# Altium project testing_board.PrjPcb
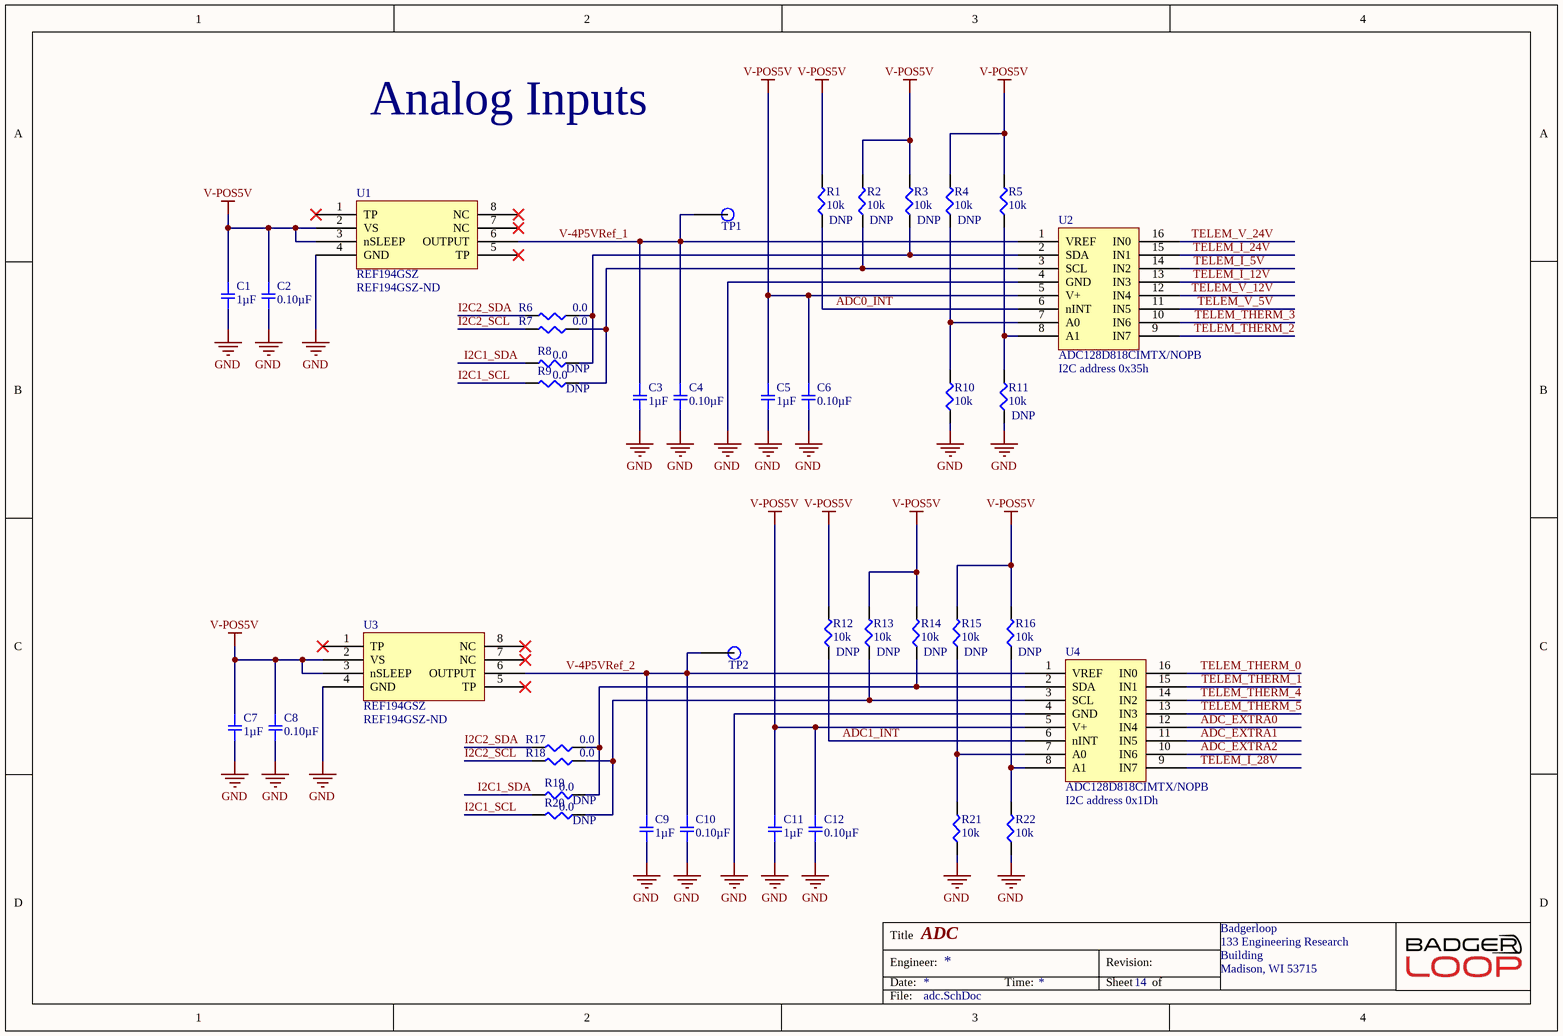
[diagram p0: adc.SchDoc]
11 sheets, 106 parts. Net scope: global (net labels, ports and power ports of the same name join across sheets).
Board file: testing_board.PcbDoc
Sheets:
  adc.SchDoc
  gpio.SchDoc
  power_5V.SchDoc
  dac.SchDoc
  pi.SchDoc
  current_source.SchDoc
  mosfet.SchDoc
  relay.SchDoc
  connectors.SchDoc
  testing_board.SchDoc
  serial.SchDoc

## Sheet adc.SchDoc: ADC
size A4; Organization: Badgerloop; Address1: 133 Engineering Research; Address2: Building; Address3: Madison, WI 53715; SheetNumber: 14

### Parts
C1  1µF  [SMD-0805C]
C2  0.10µF  [SMD-0805C]
C3  1µF  [SMD-0805C]
C4  0.10µF  [SMD-0805C]
C5  1µF  [SMD-0805C]
C6  0.10µF  [SMD-0805C]
C7  1µF  [SMD-0805C]
C8  0.10µF  [SMD-0805C]
C9  1µF  [SMD-0805C]
C10  0.10µF  [SMD-0805C]
C11  1µF  [SMD-0805C]
C12  0.10µF  [SMD-0805C]
R1  10k  [SMD-0805-RES]
R2  10k  [SMD-0805-RES]
R3  10k  [SMD-0805-RES]
R4  10k  [SMD-0805-RES]
R5  10k  [SMD-0805-RES]
R6  0.0  [SMD-0805-RES]
R7  0.0  [SMD-0805-RES]
R8  0.0  [SMD-0805-RES]
R9  0.0  [SMD-0805-RES]
R10  10k  [SMD-0805-RES]
R11  10k  [SMD-0805-RES]
R12  10k  [SMD-0805-RES]
R13  10k  [SMD-0805-RES]
R14  10k  [SMD-0805-RES]
R15  10k  [SMD-0805-RES]
R16  10k  [SMD-0805-RES]
R17  0.0  [SMD-0805-RES]
R18  0.0  [SMD-0805-RES]
R19  0.0  [SMD-0805-RES]
R20  0.0  [SMD-0805-RES]
R21  10k  [SMD-0805-RES]
R22  10k  [SMD-0805-RES]
TP1  TP  [Test Point]  (value not drawn)
TP2  TP  [Test Point]  (value not drawn)
U1  REF194GSZ  Supplier Part Number 1: REF194GSZ-ND  [SOP127P600X175-8N]
U2  ADC128D818CIMTX/NOPB  [TSOP65P660X120-16N]
U3  REF194GSZ  Supplier Part Number 1: REF194GSZ-ND  [SOP127P600X175-8N]
U4  ADC128D818CIMTX/NOPB  [TSOP65P660X120-16N]

### Nets
GND: C1.2 C2.2 C3.2 C4.2 C5.2 C6.2 C7.2 C8.2 C9.2 C10.2 C11.2 C12.2 R10.1 R11.1 R21.1 R22.1 U1.4(GND) U2.4(GND) U3.4(GND) U4.4(GND)
V-POS5V: C1.1 C2.1 C5.1 C6.1 C7.1 C8.1 C11.1 C12.1 R1.2 R2.2 R3.2 R4.2 R5.2 R12.2 R13.2 R14.2 R15.2 R16.2 U1.2(VS) U1.3(nSLEEP) U2.5(V+) U3.2(VS) U3.3(nSLEEP) U4.5(V+)
ADC0_INT: R1.1 U2.6(nINT)
ADC1_INT: R12.1 U4.6(nINT)
ADC_EXTRA0: U4.12(IN4)
ADC_EXTRA1: U4.11(IN5)
ADC_EXTRA2: U4.10(IN6)
I2C1_SCL: R9.2 R20.2
I2C1_SDA: R8.2 R19.2
I2C2_SCL: R7.2 R18.2
I2C2_SDA: R6.2 R17.2
TELEM_I_5V: U2.14(IN2)
TELEM_I_12V: U2.13(IN3)
TELEM_I_24V: U2.15(IN1)
TELEM_I_28V: U4.9(IN7)
TELEM_THERM_0: U4.16(IN0)
TELEM_THERM_1: U4.15(IN1)
TELEM_THERM_2: U2.9(IN7)
TELEM_THERM_3: U2.10(IN6)
TELEM_THERM_4: U4.14(IN2)
TELEM_THERM_5: U4.13(IN3)
TELEM_V_5V: U2.11(IN5)
TELEM_V_12V: U2.12(IN4)
TELEM_V_24V: U2.16(IN0)
V-4P5VRef_1: C3.1 C4.1 TP1.1 U1.6(OUTPUT) U2.1(VREF)
V-4P5VRef_2: C9.1 C10.1 TP2.1 U3.6(OUTPUT) U4.1(VREF)
NetR2_1: R2.1 R7.1 R9.1 U2.3(SCL)
NetR3_1: R3.1 R6.1 R8.1 U2.2(SDA)
NetR4_1: R4.1 R10.2 U2.7(A0)
NetR5_1: R5.1 R11.2 U2.8(A1)
NetR13_1: R13.1 R18.1 R20.1 U4.3(SCL)
NetR14_1: R14.1 R17.1 R19.1 U4.2(SDA)
NetR15_1: R15.1 R21.2 U4.7(A0)
NetR16_1: R16.1 R22.2 U4.8(A1)

Not connected (* = marked no-connect by the designer): U1 1(TP)* 5(TP)* 7(NC)* 8(NC)*; U3 1(TP)* 5(TP)* 7(NC)* 8(NC)*

### Notes on the sheet
- Analog Inputs
- (near U2) I2C address 0x35h
- (near U4) I2C address 0x1Dh
- Title
- Engineer:
- Date:
- Time:
- Revision:
- Sheet
- of
- File:

### Library data of the parts
C1 C3 C5 C7 C9 C11 = GRM21BR71H105KA12L: CAP CER 1UF 50V X7R 0805; Manufacturer: Murata Electronics North America; Factory Stock: 0; Unit Price (USD): 0.25; Minimum Quantity: 1; Tolerance: ±10%; Datasheets: http://www.murata.com/~/media/webrenewal/support/library/catalog/products/capacitor/mlcc/c02e.pdf; Image: //media.digikey.com/Renders/Murata%20Renders/0805%20(2012%20Metric)%20.85mm.jpg; Digi-Key Part Number: 490-4736-1-ND; Part Number: GRM21BR71H105KA12L; Quantity Available: 988032; @ qty: 0; Packaging: Cut Tape (CT); Series: GRM; Part Status: Active; Value: 1µF; Voltage: 50V; Temperature Coefficient: X7R; Operating Temperature: -55°C ~ 125°C; Features: -; Ratings: -; Applications: General Purpose; Mounting Type: Surface Mount, MLCC; Package / Case: 0805 (2012 Metric); Size / Dimension: 0.079" L x 0.049" W (2.00mm x 1.25mm); Height - Seated (Max): -; Thickness (Max): 0.053" (1.35mm); Lead Spacing: -; Lead Style: -
C2 C4 C6 C8 C10 C12 = GCD21BR71H104KA01L: CAP CER 0.1UF 50V X7R 0805; Manufacturer: Murata Electronics North America; Factory Stock: 0; Unit Price (USD): 0.24; Minimum Quantity: 1; Tolerance: ±10%; Datasheets: http://www.murata.com/~/media/webrenewal/support/library/catalog/products/capacitor/mlcc/c03e.ashx; Image: //media.digikey.com/Renders/Murata%20Renders/0805%28GxM6%29.jpg; Digi-Key Part Number: 490-11955-1-ND; Part Number: GCD21BR71H104KA01L; Quantity Available: 157; @ qty: 0; Packaging: Cut Tape (CT); Series: GCD; Part Status: Active; Value: 0.10µF; Voltage: 50V; Temperature Coefficient: X7R; Operating Temperature: -55°C ~ 125°C; Features: -; Ratings: AEC-Q200; Applications: Automotive; Mounting Type: Surface Mount, MLCC; Package / Case: 0805 (2012 Metric); Size / Dimension: 0.079" L x 0.049" W (2.00mm x 1.25mm); Height - Seated (Max): -; Thickness (Max): 0.049" (1.25mm); Lead Spacing: -; Lead Style: -
R1-R5 R10-R16 R21 R22 = ERJ-P06J103V: RES SMD 10K OHM 5% 1/2W 0805; Manufacturer: Panasonic Electronic Components; Factory Stock: 0; Unit Price (USD): 0.01839; @ qty: 1500; Minimum Quantity: 1; Power (Watts): 0.5W, 1/2W; Temperature Coefficient: ±200ppm/°C; Part Number: ERJ-P06J103V; Datasheets: https://industrial.panasonic.com/cdbs/www-data/pdf/RDA0000/AOA0000C243.pdf; Image: //media.digikey.com/Renders/Panasonic%20Renders/ERJ-0805%20Pkg.jpg; Digi-Key Part Number: P10KADCT-ND; Quantity Available: 413576; Packaging: Cut Tape (CT); Series: ERJ; Part Status: Active; Value: 10k; Tolerance: ±5%; Composition: Thick Film; Features: Automotive AEC-Q200, Pulse Withstanding; Operating Temperature: -55°C ~ 155°C; Package / Case: 0805 (2012 Metric); Supplier Device Package: 0805; Size / Dimension: 0.079" L x 0.049" W (2.00mm x 1.25mm); Height - Seated (Max): 0.028" (0.70mm); Number of Terminations: 2; Failure Rate: -
  R1-R4 R11-R16: DNP: DNP
R6-R9 R17-R20 = ERJ-6GEY0R00V: RES SMD 0.0 OHM JUMPER 1/8W 0805; Manufacturer: Panasonic Electronic Components; Factory Stock: 0; Unit Price (USD): 0.00544; @ qty: 1500; Minimum Quantity: 1; Power (Watts): 0.125W, 1/8W; Part Number: ERJ-6GEY0R00V; Datasheets: http://industrial.panasonic.com/www-cgi/jvcr13pz.cgi?E+PZ+3+AOA0001+ERJ6GEY0R00V+7+WW; Image: //media.digikey.com/Renders/Panasonic%20Renders/ERJ-0805%20Pkg.jpg; Digi-Key Part Number: P0.0ACT-ND; Quantity Available: 1597627; Packaging: Cut Tape (CT); Series: ERJ; Part Status: Active; Value: 0.0; Tolerance: Jumper; Composition: Thick Film; Features: Automotive AEC-Q200; Temperature Coefficient: -; Operating Temperature: -55°C ~ 155°C; Package / Case: 0805 (2012 Metric); Supplier Device Package: 0805; Size / Dimension: 0.079" L x 0.049" W (2.00mm x 1.25mm); Height - Seated (Max): 0.028" (0.70mm); Number of Terminations: 2; Failure Rate: -
  R8 R9 R19 R20: DNP: DNP
TP1 TP2 = TP: SMD TEST POINT
U1 U3 = REF194GSZ: IC VREF SERIES 4.5V 8SOIC; Manufacturer: Analog Devices; Max Input Voltage: 18V; Max Output Current: 30mA; Temperature Coefficient: 25ppm/°C; Number of Channels: 1; Min Output Voltage: 4.49V; Operating Supply Current: 45uA; Quiescent Current: 15uA; Min Input Voltage: 4.75V; Supplier 1: Digi-Key; Manufacturer Part Number: REF194GSZ; Stock 1: 359; Pricing 1: 1=3.56000, 10=3.19700, 25=3.02240, 100=2.61940, 250=2.48512, 500=2.22988, 1000=1.88062, 2500=1.78659 (USD); RoHS: Yes; Case/Package: R; Number of Pins: 8; Min Operating Temperature: -40°C; Max Operating Temperature: 85°C; Output Voltage: 4.5V; Packaging: Rail/Tube; Output Current: 30mA; Max Output Voltage: 4.5V; Reference Type: Series; Package Quantity: 98; Nominal Supply Current: 45uA; Reference Voltage: 4.5V; Length: 5mm; Height: 1.5mm; Width: 4mm; Radiation Hardening: No; Lead Free: Contains Lead; REACH SVHC: No SVHC; ComponentLink1URL: https://datasheet.ciiva.com/17219/ref19xseries-17219157.pdf?src-supplier=Avnet+Europe; ComponentLink1Description: https://datasheet.ciiva.com/17219/ref19xseries-17219157.pdf?src-supplier=Avnet+Europe; ComponentLink2URL: https://datasheet.ciiva.com/22666/1506113-22666153.pdf?src-supplier=Element14; ComponentLink2Description: https://datasheet.ciiva.com/22666/1506113-22666153.pdf?src-supplier=Element14; ComponentLink3URL: https://datasheet.ciiva.com/2005/ref19xseries-2005902.pdf?src-supplier=Digi-Key; ComponentLink3Description: https://datasheet.ciiva.com/2005/ref19xseries-2005902.pdf?src-supplier=Digi-Key; ComponentLink4URL: https://datasheet.ciiva.com/3235/ref19xseries-3235518.pdf?src-supplier=Avnet; ComponentLink4Description: https://datasheet.ciiva.com/3235/ref19xseries-3235518.pdf?src-supplier=Avnet
U2 U4 = ADC128D818CIMTX/NOPB: Analog to Digital Converters - ADC; Manufacturer: TI National Semiconductor; Resolution: 12b; Sampling Rate: 10000S/s; Number of A/D Converters: 1; Polarity: Unipolar; Max Supply Voltage: 5.5V; Min Supply Voltage: 3V; Interface: I2C; Number of Channels: 8; Max Power Dissipation: 33mW; Number of Converters: 4; Number of Bits: 12; Integral Nonlinearity (INL): -2LSB; Supply Type: Analog,Digital,Single; Power Consumption: 2mW; Power Dissipation: 2.01mW; Differential Nonlinearity: 1LSB; Supplier 1: Digi-Key; Manufacturer Part Number: ADC128D818CIMTX/NOPB; Stock 1: 21177; Pricing 1: 1=4.68000, 10=4.20700, 100=3.44660, 500=2.93402, 1000=2.47447 (USD); RoHS: Yes; Mount: Surface Mount; Case/Package: TSSOP; Number of Pins: 16; Contact Plating: Tin,Matte; Min Operating Temperature: -40°C; Max Operating Temperature: 125°C; Packaging: Tape and Reel; Package Quantity: 2500; Number of Inputs: 8; Number of Elements: 1; Radiation Hardening: No; Lead Free: Lead Free; ComponentLink1URL: https://datasheet.ciiva.com/14259/adc128d818-14259977.pdf?src-supplier=Avnet; ComponentLink1Description: https://datasheet.ciiva.com/14259/adc128d818-14259977.pdf?src-supplier=Avnet; Supplier Part Number 1: 296-41182-1-ND

## Sheet gpio.SchDoc: GPIO
size A4; Organization: Badgerloop; Address1: 133 Engineering Research; Address2: Building; Address3: Madison, WI 53715; SheetNumber: 18
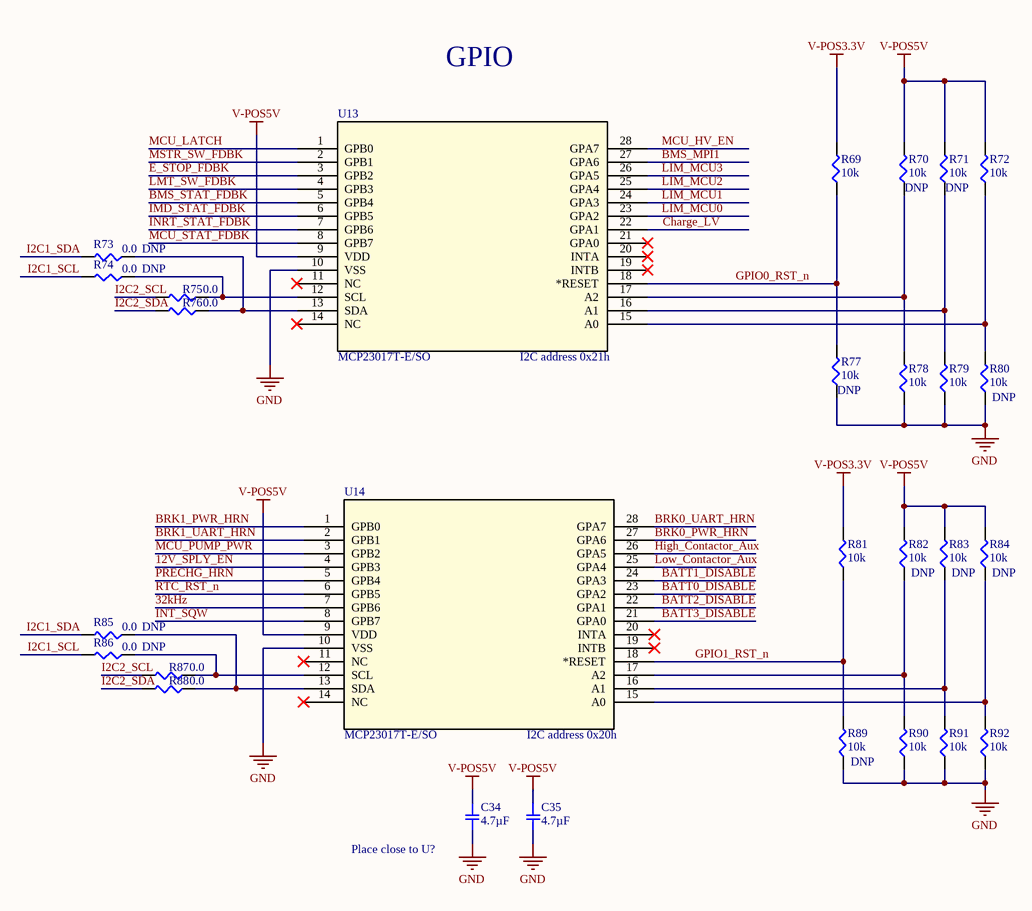
[diagram p1: gpio.SchDoc]

### Parts
C34  4.7µF  [SMD-0805C]
C35  4.7µF  [SMD-0805C]
R69  10k  [SMD-0805-RES]
R70  10k  [SMD-0805-RES]
R71  10k  [SMD-0805-RES]
R72  10k  [SMD-0805-RES]
R73  0.0  [SMD-0805-RES]
R74  0.0  [SMD-0805-RES]
R75  0.0  [SMD-0805-RES]
R76  0.0  [SMD-0805-RES]
R77  10k  [SMD-0805-RES]
R78  10k  [SMD-0805-RES]
R79  10k  [SMD-0805-RES]
R80  10k  [SMD-0805-RES]
R81  10k  [SMD-0805-RES]
R82  10k  [SMD-0805-RES]
R83  10k  [SMD-0805-RES]
R84  10k  [SMD-0805-RES]
R85  0.0  [SMD-0805-RES]
R86  0.0  [SMD-0805-RES]
R87  0.0  [SMD-0805-RES]
R88  0.0  [SMD-0805-RES]
R89  10k  [SMD-0805-RES]
R90  10k  [SMD-0805-RES]
R91  10k  [SMD-0805-RES]
R92  10k  [SMD-0805-RES]
U13  MCP23017T-E/SO  [SOIC28-W_MC-M]
U14  MCP23017T-E/SO  [SOIC28-W_MC-M]

### Nets
GND: C34.2 C35.2 R77.1 R78.1 R79.1 R80.1 R89.1 R90.1 R91.1 R92.1 U13.10(VSS) U14.10(VSS)
V-POS3.3V: R69.2 R81.2
V-POS5V: C34.1 C35.1 R70.2 R71.2 R72.2 R82.2 R83.2 R84.2 U13.9(VDD) U14.9(VDD)
12V_SPLY_EN: U14.4(GPB3)
32kHz: U14.7(GPB6)
BATT0_DISABLE: U14.23(GPA2)
BATT1_DISABLE: U14.24(GPA3)
BATT2_DISABLE: U14.22(GPA1)
BATT3_DISABLE: U14.21(GPA0)
BMS_MPI1: U13.27(GPA6)
BMS_STAT_FDBK: U13.5(GPB4)
BRK0_PWR_HRN: U14.27(GPA6)
BRK0_UART_HRN: U14.28(GPA7)
BRK1_PWR_HRN: U14.1(GPB0)
BRK1_UART_HRN: U14.2(GPB1)
Charge_LV: U13.22(GPA1)
E_STOP_FDBK: U13.3(GPB2)
GPIO0_RST_n: R69.1 R77.2 U13.18(*RESET)
GPIO1_RST_n: R81.1 R89.2 U14.18(*RESET)
High_Contactor_Aux: U14.26(GPA5)
I2C1_SCL: R74.2 R86.2
I2C1_SDA: R73.2 R85.2
I2C2_SCL: R75.2 R87.2
I2C2_SDA: R76.2 R88.2
IMD_STAT_FDBK: U13.6(GPB5)
INRT_STAT_FDBK: U13.7(GPB6)
INT_SQW: U14.8(GPB7)
LIM_MCU0: U13.23(GPA2)
LIM_MCU1: U13.24(GPA3)
LIM_MCU2: U13.25(GPA4)
LIM_MCU3: U13.26(GPA5)
LMT_SW_FDBK: U13.4(GPB3)
Low_Contactor_Aux: U14.25(GPA4)
MCU_HV_EN: U13.28(GPA7)
MCU_LATCH: U13.1(GPB0)
MCU_PUMP_PWR: U14.3(GPB2)
MCU_STAT_FDBK: U13.8(GPB7)
MSTR_SW_FDBK: U13.2(GPB1)
PRECHG_HRN: U14.5(GPB4)
RTC_RST_n: U14.6(GPB5)
NetR70_1: R70.1 R78.2 U13.17(A2)
NetR71_1: R71.1 R79.2 U13.16(A1)
NetR72_1: R72.1 R80.2 U13.15(A0)
NetR73_1: R73.1 R76.1 U13.13(SDA)
NetR74_1: R74.1 R75.1 U13.12(SCL)
NetR82_1: R82.1 R90.2 U14.17(A2)
NetR83_1: R83.1 R91.2 U14.16(A1)
NetR84_1: R84.1 R92.2 U14.15(A0)
NetR85_1: R85.1 R88.1 U14.13(SDA)
NetR86_1: R86.1 R87.1 U14.12(SCL)

Not connected (* = marked no-connect by the designer): U13 11(NC)* 14(NC)* 19(INTB)* 20(INTA)* 21(GPA0)*; U14 11(NC)* 14(NC)* 19(INTB)* 20(INTA)*

### Notes on the sheet
- GPIO
- (near U13) I2C address 0x21h
- (near U14) I2C address 0x20h
- (near C34) Place close to U?
- Title
- Engineer:
- Date:
- Time:
- Revision:
- Sheet
- of
- File:

### Library data of the parts
C34 C35 = GRM21BR60J475KA11L: CAP CER 4.7UF 6.3V X5R 0805; Manufacturer: Murata Electronics North America; Factory Stock: 0; Unit Price (USD): 0.28; Minimum Quantity: 1; Tolerance: ±10%; Datasheets: http://www.murata.com/~/media/webrenewal/support/library/catalog/products/capacitor/mlcc/c02e.pdf; Image: //media.digikey.com/Renders/Murata%20Renders/0805%20(2012%20Metric)%20.85mm.jpg; Digi-Key Part Number: 490-9749-1-ND; Part Number: GRM21BR60J475KA11L; Quantity Available: 2821; @ qty: 0; Packaging: Cut Tape (CT); Series: GRM; Part Status: Active; Value: 4.7µF; Voltage: 6.3V; Temperature Coefficient: X5R; Operating Temperature: -55°C ~ 85°C; Features: -; Ratings: -; Applications: General Purpose; Mounting Type: Surface Mount, MLCC; Package / Case: 0805 (2012 Metric); Size / Dimension: 0.079" L x 0.049" W (2.00mm x 1.25mm); Height - Seated (Max): -; Thickness (Max): 0.055" (1.40mm); Lead Spacing: -; Lead Style: -
R69-R72 R77-R84 R89-R92 = ERJ-P06J103V: as R1 on sheet adc; Part Number: ERJ-P06J103V; Datasheets: https://industrial.panasonic.com/cdbs/www-data/pdf/RDA0000/AOA0000C243.pdf; Image: //media.digikey.com/Renders/Panasonic%20Renders/ERJ-0805%20Pkg.jpg; Digi-Key Part Number: P10KADCT-ND; Quantity Available: 413576; Packaging: Cut Tape (CT); Series: ERJ; Part Status: Active; Value: 10k; Tolerance: ±5%; Composition: Thick Film; Features: Automotive AEC-Q200, Pulse Withstanding; Operating Temperature: -55°C ~ 155°C; Package / Case: 0805 (2012 Metric); Supplier Device Package: 0805; Size / Dimension: 0.079" L x 0.049" W (2.00mm x 1.25mm); Height - Seated (Max): 0.028" (0.70mm); Number of Terminations: 2; Failure Rate: -
  R70 R71 R77 R80 R82-R84 R89: DNP: DNP
R73-R76 R85-R88 = ERJ-6GEY0R00V: as R6 on sheet adc; Part Number: ERJ-6GEY0R00V; Datasheets: http://industrial.panasonic.com/www-cgi/jvcr13pz.cgi?E+PZ+3+AOA0001+ERJ6GEY0R00V+7+WW; Image: //media.digikey.com/Renders/Panasonic%20Renders/ERJ-0805%20Pkg.jpg; Digi-Key Part Number: P0.0ACT-ND; Quantity Available: 1597627; Packaging: Cut Tape (CT); Series: ERJ; Part Status: Active; Value: 0.0; Tolerance: Jumper; Composition: Thick Film; Features: Automotive AEC-Q200; Temperature Coefficient: -; Operating Temperature: -55°C ~ 155°C; Package / Case: 0805 (2012 Metric); Supplier Device Package: 0805; Size / Dimension: 0.079" L x 0.049" W (2.00mm x 1.25mm); Height - Seated (Max): 0.028" (0.70mm); Number of Terminations: 2; Failure Rate: -
  R73 R74 R85 R86: DNP: DNP
U13 U14 = MCP23017T-E/SO: IC I/O EXPANDER I2C 16B 28SOIC; Manufacturer: Microchip; Manufacturer P/N: MCP23017T-E/SO; Digikey P/N: MCP23017T-E/SOCT-ND; Digikey Link: https://www.digikey.com/product-detail/en/microchip-technology/MCP23017T-E-SO/MCP23017T-E-SOCT-ND/5358289

## Sheet power_5V.SchDoc: VBUS
size A4; Organization: Badgerloop Electrical; Address1: 133 Engineering Research Building; Address2: 1500 Engineering Drive; Address3: Madison, Wi 53706; SheetNumber: 5
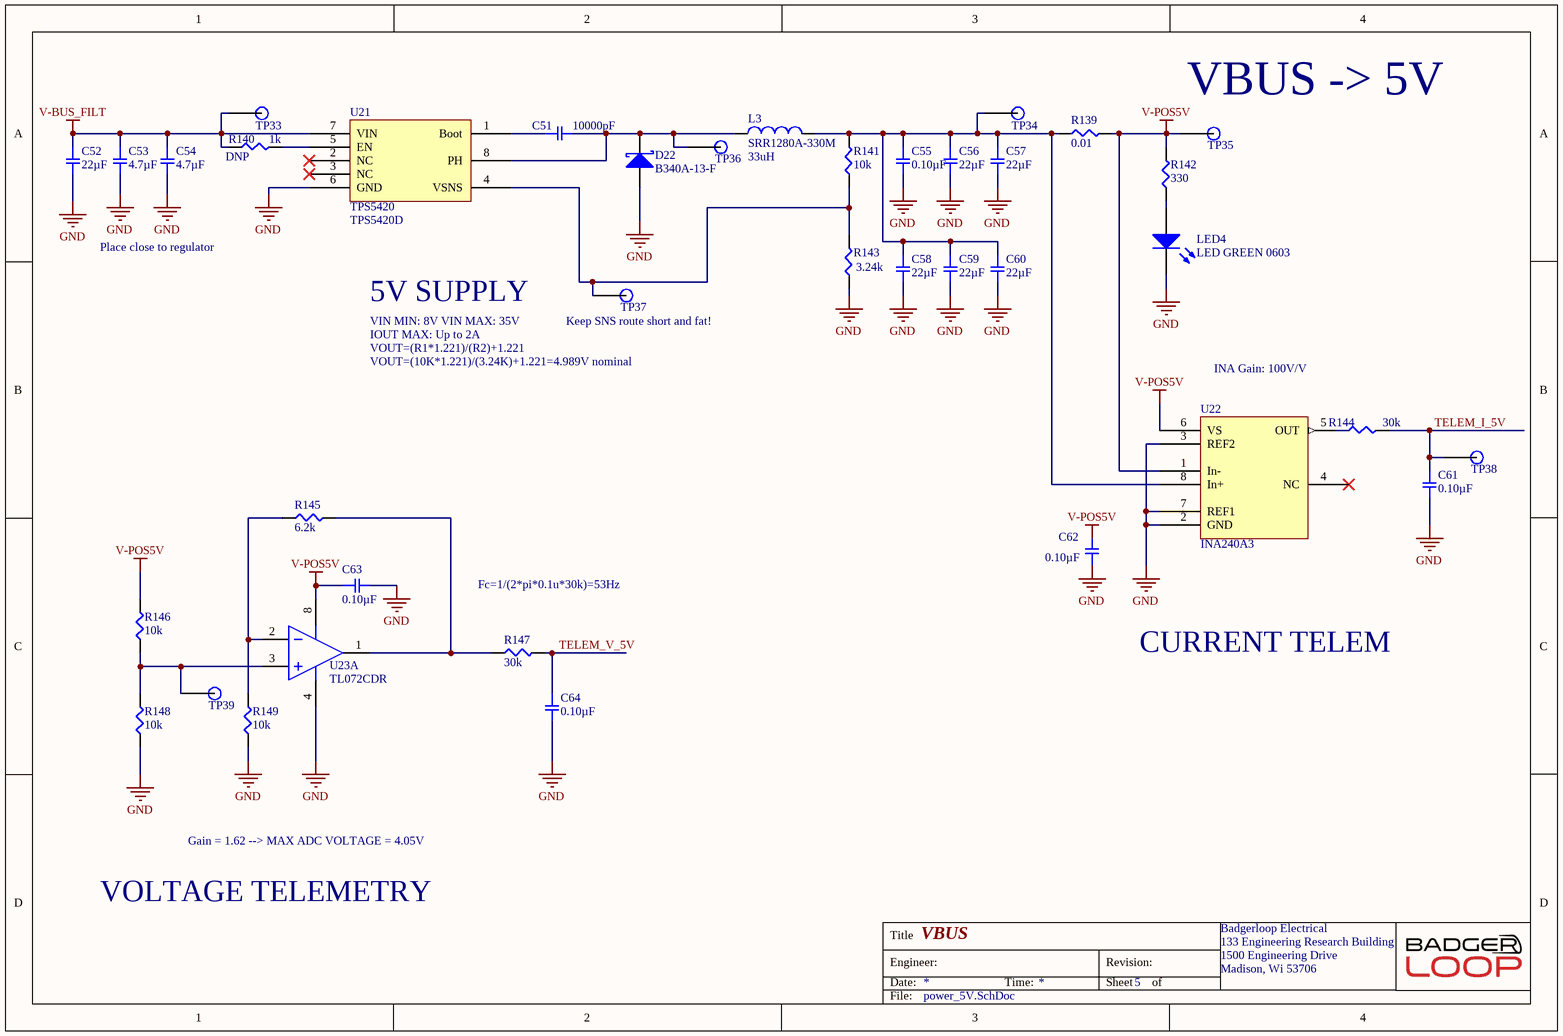
[diagram p2: power_5V.SchDoc]

### Parts
C51  10000pF  [SMD-0805C]
C52  22µF  [SMD-1206C]
C53  4.7µF  [SMD-1206C]
C54  4.7µF  [SMD-1206C]
C55  0.10µF  [SMD-0805C]
C56  22µF  [SMD-1206C]
C57  22µF  [SMD-1206C]
C58  22µF  [SMD-1206C]
C59  22µF  [SMD-1206C]
C60  22µF  [SMD-1206C]
C61  0.10µF  [SMD-0805C]
C62  0.10µF  [SMD-0805C]
C63  0.10µF  [SMD-0805C]
C64  0.10µF  [SMD-0805C]
D22  B340A-13-F  [DIOM4326X20N]
L3  SRR1280A-330M  Inductance: 33uH  [INDM120125X75N]
LED4  LED GREEN 0603  [LED 0603 GREEN]
R139  0.01  [SMD-1206-RES]
R140  1k  [SMD-0805-RES]
R141  10k  [SMD-0805-RES]
R142  330  [SMD-0805-RES]
R143  3.24k  [SMD-0805-RES]
R144  30k  [SMD-0805-RES]
R145  6.2k  [SMD-0805-RES]
R146  10k  [SMD-0805-RES]
R147  30k  [SMD-0805-RES]
R148  10k  [SMD-0805-RES]
R149  10k  [SMD-0805-RES]
TP33  TP  [Test Point]  (value not drawn)
TP34  TP  [Test Point]  (value not drawn)
TP35  TP  [Test Point]  (value not drawn)
TP36  TP  [Test Point]  (value not drawn)
TP37  TP  [Test Point]  (value not drawn)
TP38  TP  [Test Point]  (value not drawn)
TP39  TP  [Test Point]  (value not drawn)
U21  TPS5420  Manufacturer Part Number: TPS5420D  [SOP127P600X175-8N]
U22  INA240A3  [SOIC127P600X175-8N]
U23  TL072CDR  [SOP127P600X175-8N]  (part A of 2)

### Nets
GND: C52.2 C53.2 C54.2 C55.2 C56.2 C57.2 C58.2 C59.2 C60.2 C61.2 C62.1 C63.2 C64.2 D22.2(A) LED4.2(K) R143.1 R148.1 R149.1 U21.6(GND) U22.2(GND) U22.3(REF2) U22.7(REF1) U23.4(V-)
V-BUS_FILT: C52.1 C53.1 C54.1 R140.1 TP33.1 U21.7(VIN)
V-POS5V: C62.2 C63.1 R139.2 R142.2 R146.2 TP35.1 U22.1(In-) U22.6(VS) U23.8(V+)
TELEM_I_5V: C61.1 R144.2 TP38.1
TELEM_V_5V: C64.1 R147.2
NetC51_1: C51.1 U21.1(Boot)
NetC51_2: C51.2 D22.1(K) L3.1 TP36.1 U21.8(PH)
NetC55_1: C55.1 C56.1 C57.1 C58.1 C59.1 C60.1 L3.2 R139.1 R141.2 TP34.1 U22.8(In+)
NetLED4_1: LED4.1(A) R142.1
NetR140_2: R140.2 U21.5(EN)
NetR141_1: R141.1 R143.2 TP37.1 U21.4(VSNS)
NetR144_1: R144.1 U22.5(OUT)
NetR145_1: R145.1 R149.2 U23.2(IN-)
NetR145_2: R145.2 R147.1 U23.1(OUT)
NetR146_1: R146.1 R148.2 TP39.1 U23.3(IN+)

Not connected (* = marked no-connect by the designer): U21 2(NC)* 3(NC)*; U22 4(NC)*

### Notes on the sheet
- (near TP35) VBUS -> 5V
- Place close to regulator
- 5V SUPPLY
- VIN MIN: 8V VIN MAX: 35V
- IOUT MAX: Up to 2A
- VOUT=(R1*1.221)/(R2)+1.221
- VOUT=(10K*1.221)/(3.24K)+1.221=4.989V nominal
- (near TP37) Keep SNS route short and fat!
- INA Gain: 100V/V
- Fc=1/(2*pi*0.1u*30k)=53Hz
- CURRENT TELEM
- Gain = 1.62 --> MAX ADC VOLTAGE = 4.05V
- VOLTAGE TELEMETRY
- Title
- Engineer:
- Date:
- Time:
- Revision:
- Sheet
- of
- File:

### Library data of the parts
C51 = GC321AD72E103KX01D: CAP CER 10000PF 250V X7T 0805; Manufacturer: Murata Electronics North America; Factory Stock: 0; Unit Price (USD): 0.3; Minimum Quantity: 1; Tolerance: ±10%; Datasheets: http://search.murata.co.jp/Ceramy/image/img/A01X/G101/ENG/GC321AD72E103KX01-01.pdf; Image: //media.digikey.com/Renders/Murata%20Renders/0805(GC3)200x125.jpg; Digi-Key Part Number: 490-13986-1-ND; Part Number: GC321AD72E103KX01D; Quantity Available: 4000; @ qty: 0; Packaging: Cut Tape (CT); Series: GC3; Part Status: Active; Value: 10000pF; Voltage: 250V; Temperature Coefficient: X7T; Operating Temperature: -55°C ~ 125°C; Features: -; Ratings: AEC-Q200; Applications: Automotive; Mounting Type: Surface Mount, MLCC; Package / Case: 0805 (2012 Metric); Size / Dimension: 0.079" L x 0.049" W (2.00mm x 1.25mm); Height - Seated (Max): -; Thickness (Max): 0.039" (1.00mm); Lead Spacing: -; Lead Style: -
C52 C56-C60 = GRT31CR61E226ME01L: CAP CER 22UF 25V X5R 1206; Manufacturer: Murata Electronics North America; Factory Stock: 0; Unit Price (USD): 0.52; Minimum Quantity: 1; Tolerance: ±20%; Datasheets: http://search.murata.co.jp/Ceramy/image/img/A01X/G101/ENG/GRT31CR61E226ME01-01.pdf; Image: //media.digikey.com/Renders/Murata%20Renders/GR331BD72E473KW01L.jpg; Digi-Key Part Number: 490-12451-1-ND; Part Number: GRT31CR61E226ME01L; Quantity Available: 4719; @ qty: 0; Packaging: Cut Tape (CT); Series: GRT; Part Status: Active; Value: 22µF; Voltage: 25V; Temperature Coefficient: X5R; Operating Temperature: -55°C ~ 85°C; Features: -; Ratings: AEC-Q200; Applications: Automotive; Mounting Type: Surface Mount, MLCC; Package / Case: 1206 (3216 Metric); Size / Dimension: 0.126" L x 0.063" W (3.20mm x 1.60mm); Height - Seated (Max): -; Thickness (Max): 0.071" (1.80mm); Lead Spacing: -; Lead Style: -
C53 C54 = GCM31CC71H475KA03L: CAP CER 4.7UF 50V X7S 1206; Manufacturer: Murata Electronics North America; Factory Stock: 0; Unit Price (USD): 0.57; Minimum Quantity: 1; Tolerance: ±10%; Datasheets: http://www.murata.com/~/media/webrenewal/support/library/catalog/products/capacitor/mlcc/c03e.ashx; Image: //media.digikey.com/Renders/Murata%20Renders/GR331BD72E473KW01L.jpg; Digi-Key Part Number: 490-11167-1-ND; Part Number: GCM31CC71H475KA03L; Quantity Available: 11700; @ qty: 0; Packaging: Cut Tape (CT); Series: GCM; Part Status: Active; Value: 4.7µF; Voltage: 50V; Temperature Coefficient: X7S; Operating Temperature: -55°C ~ 125°C; Features: -; Ratings: AEC-Q200; Applications: Automotive; Mounting Type: Surface Mount, MLCC; Package / Case: 1206 (3216 Metric); Size / Dimension: 0.126" L x 0.063" W (3.20mm x 1.60mm); Height - Seated (Max): -; Thickness (Max): 0.071" (1.80mm); Lead Spacing: -; Lead Style: -
C55 C62 C63 = GRM21B7U1A104JA01L: CAP CER 0.1UF 10V U2J 0805; Manufacturer: Murata Electronics North America; Factory Stock: 0; Unit Price (USD): 0.4; Minimum Quantity: 1; Tolerance: ±5%; Datasheets: http://www.murata.com/~/media/webrenewal/support/library/catalog/products/capacitor/mlcc/c02e.pdf; Image: //media.digikey.com/Renders/Murata%20Renders/0805%20(2012%20Metric)%20.85mm.jpg; Digi-Key Part Number: 490-11592-1-ND; Part Number: GRM21B7U1A104JA01L; Quantity Available: 3390; @ qty: 0; Packaging: Cut Tape (CT); Series: GRM; Part Status: Active; Value: 0.10µF; Voltage: 10V; Temperature Coefficient: U2J; Operating Temperature: -55°C ~ 125°C; Features: -; Ratings: -; Applications: General Purpose; Mounting Type: Surface Mount, MLCC; Package / Case: 0805 (2012 Metric); Size / Dimension: 0.079" L x 0.049" W (2.00mm x 1.25mm); Height - Seated (Max): -; Thickness (Max): 0.053" (1.35mm); Lead Spacing: -; Lead Style: -
C61 C64 = GRM219R71C104KA01D: CAP CER 0.1UF 16V X7R 0805; Manufacturer: Murata Electronics North America; Factory Stock: 0; Unit Price (USD): 0.13; Minimum Quantity: 1; Tolerance: ±10%; Datasheets: http://www.murata.com/~/media/webrenewal/support/library/catalog/products/capacitor/mlcc/c02e.pdf; Image: //media.digikey.com/Renders/Murata%20Renders/0805%20(2012%20Metric)%20.85mm.jpg; Digi-Key Part Number: 490-1683-1-ND; Part Number: GRM219R71C104KA01D; Quantity Available: 265464; @ qty: 0; Packaging: Cut Tape (CT); Series: GRM; Part Status: Active; Value: 0.10µF; Voltage: 16V; Temperature Coefficient: X7R; Operating Temperature: -55°C ~ 125°C; Features: -; Ratings: -; Applications: General Purpose; Mounting Type: Surface Mount, MLCC; Package / Case: 0805 (2012 Metric); Size / Dimension: 0.079" L x 0.049" W (2.00mm x 1.25mm); Height - Seated (Max): -; Thickness (Max): 0.037" (0.95mm); Lead Spacing: -; Lead Style: -
D22 = B340A-13-F: DIODE SCHOTTKY 40V 3A SMA; Manufacturer: Diodes; Element Configuration: Single; Peak Reverse Current: 500uA; Forward Voltage: 500mV; Max Forward Surge Current (Ifsm): 80A; Polarity: Standard; Capacitance: 250pF; Supplier 1: Digi-Key; Stock 1: 438328; Pricing 1: 1=0.42000, 10=0.33900, 100=0.23070, 500=0.17304, 1000=0.12978 (USD); RoHS: Yes; Mount: Surface Mount; Case/Package: SMA; Number of Pins: 2; Weight: 0.002258oz; Contact Plating: Tin,Matte; Min Operating Temperature: -55°C; Max Operating Temperature: 125°C; Forward Current: 3A; Max Repetitive Reverse Voltage (Vrrm): 40V; Packaging: Tape and Reel; Peak Non-Repetitive Surge Current: 80A; Package Quantity: 5000; Average Rectified Current: 3A; Termination: SMD/SMT; Voltage Rating (DC): 40V; Current Rating: 3A; Output Current: 3A; Current: 3A; Voltage: 40V; Max Reverse Voltage (DC): 40V; Length: 4.6mm; Height: 2.3mm; Width: 2.92mm; Radiation Hardening: No; REACH SVHC: No SVHC; Lead Free: Lead Free; ComponentLink1URL: https://datasheet.ciiva.com/26949/getdatasheetpartid-143394-26949352.pdf?src-supplier=Verical; ComponentLink1Description: https://datasheet.ciiva.com/26949/getdatasheetpartid-143394-26949352.pdf?src-supplier=Verical; ComponentLink2URL: https://datasheet.ciiva.com/4245/861ds30891-4245763.pdf?src-supplier=Arrow; ComponentLink2Description: https://datasheet.ciiva.com/4245/861ds30891-4245763.pdf?src-supplier=Arrow; ComponentLink3URL: https://datasheet.ciiva.com/1177/ds30891-1177476.pdf?src-supplier=Element14; ComponentLink3Description: https://datasheet.ciiva.com/1177/ds30891-1177476.pdf?src-supplier=Element14; ComponentLink4URL: https://datasheet.ciiva.com/913/ds30891-913638.pdf?src-supplier=Digi-Key; ComponentLink4Description: https://datasheet.ciiva.com/913/ds30891-913638.pdf?src-supplier=Digi-Key; ComponentLink5URL: https://datasheet.ciiva.com/46393/1911813-46393773.pdf?src-supplier=Element14; ComponentLink5Description: https://datasheet.ciiva.com/46393/1911813-46393773.pdf?src-supplier=Element14; ComponentLink6URL: https://datasheet.ciiva.com/1240/ds30891-1240228.pdf?src-supplier=Newark; ComponentLink6Description: https://datasheet.ciiva.com/1240/ds30891-1240228.pdf?src-supplier=Newark; ComponentLink7URL: https://datasheet.ciiva.com/913/ds30891-913637.pdf?src-supplier=Digi-Key; ComponentLink7Description: https://datasheet.ciiva.com/913/ds30891-913637.pdf?src-supplier=Digi-Key; ComponentLink8URL: https://datasheet.ciiva.com/913/ds30891-913639.pdf?src-supplier=Digi-Key; ComponentLink8Description: https://datasheet.ciiva.com/913/ds30891-913639.pdf?src-supplier=Digi-Key; Supplier Part Number 1: B340A-FDICT-ND
L3 = SRR1280A-330M: Inductor Power Shielded Wirewound 33uH 20% 1KHz 28Q-Factor Ferrite 3.5A 57mOhm DCR Automotive T/R; Manufacturer: Bourns; Saturation Current: 3.3A; DC Resistance (DCR): 57mR; Self Resonant Frequency: 9.5MHz; Supplier 1: Newark; Stock 1: 0; Pricing 1: 2400=0.54000, 4000=0.48600, 6000=0.46800, 10000=0.45800 (USD); RoHS: Yes; Mount: Surface Mount; Case/Package: Nonstandard; Core Material: Ferrite; Min Operating Temperature: -40°C; Max Operating Temperature: 125°C; Package Quantity: 400; Packaging: Cut Tape; Tolerance: 20%; Current Rating: 3.5A; Shielding: Shielded; Test Frequency: 1kHz; Inductance Tolerance: 20%; RMS Current (Irms): 3.5A; Military Standard: Not; Max DC Current: 3.5A; Length: 0.492inch; Height: 7.5mm; Width: 0.492inch; Height - Seated (Max): 0.315inch; Depth: 12.8mm; Ratings: AEC-Q200; REACH SVHC: No SVHC; ComponentLink1URL: https://datasheet.ciiva.com/41859/srr1280a-41859670.pdf?src-supplier=Digi-Key; ComponentLink1Description: https://datasheet.ciiva.com/41859/srr1280a-41859670.pdf?src-supplier=Digi-Key; ComponentLink2URL: https://datasheet.ciiva.com/48684/srr1280a-48684991.pdf?src-supplier=Avnet; ComponentLink2Description: https://datasheet.ciiva.com/48684/srr1280a-48684991.pdf?src-supplier=Avnet; Supplier Part Number 1: 06X7909
LED4 = LED GREEN 0603: Manufacturer: Lite-On Inc.; Manufacturer P/N: LTST-C190KGKT; Digikey P/N: 160-1435-1-ND; Package / Case: 0603; Color: GREEN
R139 = ERJ-MP2KF10MU: RES SMD 0.01 OHM 1% 1/2W 1206; Manufacturer: Panasonic Electronic Components; Factory Stock: 0; Unit Price (USD): 0.15792; @ qty: 1500; Minimum Quantity: 1; Power (Watts): 0.5W, 1/2W; Temperature Coefficient: ±75ppm/°C; Part Number: ERJ-MP2KF10MU; Datasheets: https://industrial.panasonic.com/cdbs/www-data/pdf/RDA0000/AOA0000C263.pdf; Image: //media.digikey.com/Photos/Panasonic%20Elect%20Works%20Photos/MFG_ERJ-MS4.jpg; Digi-Key Part Number: P19322CT-ND; Quantity Available: 2909; Packaging: Cut Tape (CT); Series: ERJ; Part Status: Active; Value: 0.01; Tolerance: ±1%; Composition: Metal Element; Features: Automotive AEC-Q200, Current Sense, Moisture Resistant; Operating Temperature: -65°C ~ 170°C; Package / Case: 1206 (3216 Metric); Supplier Device Package: 1206; Size / Dimension: 0.125" L x 0.063" W (3.18mm x 1.60mm); Height - Seated (Max): 0.045" (1.15mm); Number of Terminations: 2; Failure Rate: -
R140 = ERJ-P06J102V: RES SMD 1K OHM 5% 1/2W 0805; Manufacturer: Panasonic Electronic Components; Factory Stock: 0; Unit Price (USD): 0.01839; @ qty: 1500; Minimum Quantity: 1; Power (Watts): 0.5W, 1/2W; Temperature Coefficient: ±200ppm/°C; Part Number: ERJ-P06J102V; Datasheets: https://industrial.panasonic.com/cdbs/www-data/pdf/RDA0000/AOA0000C243.pdf; Image: //media.digikey.com/Renders/Panasonic%20Renders/ERJ-0805%20Pkg.jpg; Digi-Key Part Number: P1.0KADCT-ND; Quantity Available: 124757; Packaging: Cut Tape (CT); Series: ERJ; Part Status: Active; Value: 1k; Tolerance: ±5%; Composition: Thick Film; Features: Automotive AEC-Q200, Pulse Withstanding; Operating Temperature: -55°C ~ 155°C; Package / Case: 0805 (2012 Metric); Supplier Device Package: 0805; Size / Dimension: 0.079" L x 0.049" W (2.00mm x 1.25mm); Height - Seated (Max): 0.028" (0.70mm); Number of Terminations: 2; Failure Rate: -; DNP: DNP
R141 R146 R148 R149 = ERJ-P06J103V: as R1 on sheet adc; Part Number: ERJ-P06J103V; Datasheets: https://industrial.panasonic.com/cdbs/www-data/pdf/RDA0000/AOA0000C243.pdf; Image: //media.digikey.com/Renders/Panasonic%20Renders/ERJ-0805%20Pkg.jpg; Digi-Key Part Number: P10KADCT-ND; Quantity Available: 413576; Packaging: Cut Tape (CT); Series: ERJ; Part Status: Active; Value: 10k; Tolerance: ±5%; Composition: Thick Film; Features: Automotive AEC-Q200, Pulse Withstanding; Operating Temperature: -55°C ~ 155°C; Package / Case: 0805 (2012 Metric); Supplier Device Package: 0805; Size / Dimension: 0.079" L x 0.049" W (2.00mm x 1.25mm); Height - Seated (Max): 0.028" (0.70mm); Number of Terminations: 2; Failure Rate: -
R142 = ERJ-P06J331V: RES SMD 330 OHM 5% 1/2W 0805; Manufacturer: Panasonic Electronic Components; Factory Stock: 0; Unit Price (USD): 0.01839; @ qty: 1500; Minimum Quantity: 1; Power (Watts): 0.5W, 1/2W; Temperature Coefficient: ±200ppm/°C; Part Number: ERJ-P06J331V; Datasheets: https://industrial.panasonic.com/cdbs/www-data/pdf/RDA0000/AOA0000C243.pdf; Image: //media.digikey.com/Renders/Panasonic%20Renders/ERJ-0805%20Pkg.jpg; Digi-Key Part Number: P330ADCT-ND; Quantity Available: 74125; Packaging: Cut Tape (CT); Series: ERJ; Part Status: Active; Value: 330; Tolerance: ±5%; Composition: Thick Film; Features: Automotive AEC-Q200, Pulse Withstanding; Operating Temperature: -55°C ~ 155°C; Package / Case: 0805 (2012 Metric); Supplier Device Package: 0805; Size / Dimension: 0.079" L x 0.049" W (2.00mm x 1.25mm); Height - Seated (Max): 0.028" (0.70mm); Number of Terminations: 2; Failure Rate: -
R143 = ERJ-6ENF3241V: RES SMD 3.24K OHM 1% 1/8W 0805; Manufacturer: Panasonic Electronic Components; Factory Stock: 0; Unit Price (USD): 0.00729; @ qty: 1500; Minimum Quantity: 1; Power (Watts): 0.125W, 1/8W; Temperature Coefficient: ±100ppm/°C; Part Number: ERJ-6ENF3241V; Datasheets: http://industrial.panasonic.com/www-cgi/jvcr13pz.cgi?E+PZ+3+AOA0002+ERJ6ENF3241V+7+WW; Image: //media.digikey.com/Renders/Panasonic%20Renders/ERJ-0805%20Pkg.jpg; Digi-Key Part Number: P3.24KCCT-ND; Quantity Available: 47619; Packaging: Cut Tape (CT); Series: ERJ; Part Status: Active; Value: 3.24k; Tolerance: ±1%; Composition: Thick Film; Features: Automotive AEC-Q200; Operating Temperature: -55°C ~ 155°C; Package / Case: 0805 (2012 Metric); Supplier Device Package: 0805; Size / Dimension: 0.079" L x 0.049" W (2.00mm x 1.25mm); Height - Seated (Max): 0.028" (0.70mm); Number of Terminations: 2; Failure Rate: -
R144 = ERJ-6ENF3002V: RES SMD 30K OHM 1% 1/8W 0805; Manufacturer: Panasonic Electronic Components; Factory Stock: 0; Unit Price (USD): 0.00729; @ qty: 1500; Minimum Quantity: 1; Power (Watts): 0.125W, 1/8W; Temperature Coefficient: ±100ppm/°C; Part Number: ERJ-6ENF3002V; Datasheets: http://industrial.panasonic.com/www-cgi/jvcr13pz.cgi?E+PZ+3+AOA0002+ERJ6ENF3002V+7+WW; Image: //media.digikey.com/Renders/Panasonic%20Renders/ERJ-0805%20Pkg.jpg; Digi-Key Part Number: P30.0KCCT-ND; Quantity Available: 88046; Packaging: Cut Tape (CT); Series: ERJ; Part Status: Active; Value: 30k; Tolerance: ±1%; Composition: Thick Film; Features: Automotive AEC-Q200; Operating Temperature: -55°C ~ 155°C; Package / Case: 0805 (2012 Metric); Supplier Device Package: 0805; Size / Dimension: 0.079" L x 0.049" W (2.00mm x 1.25mm); Height - Seated (Max): 0.028" (0.70mm); Number of Terminations: 2; Failure Rate: -
R145 = ERJ-P06J622V: RES SMD 6.2K OHM 5% 1/2W 0805; Manufacturer: Panasonic Electronic Components; Factory Stock: 0; Unit Price (USD): 0.01839; @ qty: 1500; Minimum Quantity: 1; Power (Watts): 0.5W, 1/2W; Temperature Coefficient: ±200ppm/°C; Part Number: ERJ-P06J622V; Datasheets: https://industrial.panasonic.com/cdbs/www-data/pdf/RDA0000/AOA0000C243.pdf; Image: //media.digikey.com/Renders/Panasonic%20Renders/ERJ-0805%20Pkg.jpg; Digi-Key Part Number: P6.2KADCT-ND; Quantity Available: 14652; Packaging: Cut Tape (CT); Series: ERJ; Part Status: Active; Value: 6.2k; Tolerance: ±5%; Composition: Thick Film; Features: Automotive AEC-Q200, Pulse Withstanding; Operating Temperature: -55°C ~ 155°C; Package / Case: 0805 (2012 Metric); Supplier Device Package: 0805; Size / Dimension: 0.079" L x 0.049" W (2.00mm x 1.25mm); Height - Seated (Max): 0.028" (0.70mm); Number of Terminations: 2; Failure Rate: -
R147 = ERJ-P06J303V: RES SMD 30K OHM 5% 1/2W 0805; Manufacturer: Panasonic Electronic Components; Factory Stock: 0; Unit Price (USD): 0.01839; @ qty: 1500; Minimum Quantity: 1; Power (Watts): 0.5W, 1/2W; Temperature Coefficient: ±200ppm/°C; Part Number: ERJ-P06J303V; Datasheets: https://industrial.panasonic.com/cdbs/www-data/pdf/RDA0000/AOA0000C243.pdf; Image: //media.digikey.com/Renders/Panasonic%20Renders/ERJ-0805%20Pkg.jpg; Digi-Key Part Number: P30KADCT-ND; Quantity Available: 7773; Packaging: Cut Tape (CT); Series: ERJ; Part Status: Active; Value: 30k; Tolerance: ±5%; Composition: Thick Film; Features: Automotive AEC-Q200, Pulse Withstanding; Operating Temperature: -55°C ~ 155°C; Package / Case: 0805 (2012 Metric); Supplier Device Package: 0805; Size / Dimension: 0.079" L x 0.049" W (2.00mm x 1.25mm); Height - Seated (Max): 0.028" (0.70mm); Number of Terminations: 2; Failure Rate: -
TP33-TP39 = TP: SMD TEST POINT
U21 = TPS5420: Manufacturer: Texas Instruments; Output Current: 2A; Switching Frequency: 500kHz; Output Voltage: 31V; Quiescent Current: 3mA; Number of Outputs: 1; Max Input Voltage: 36V; Min Input Voltage: 5.5V; Synchronous Rectifier: No; Min Output Voltage: 1.23V; Output Type: Adjustable; Efficiency: 95%; Supplier 1: Digi-Key; Stock 1: 5221; Pricing 1: 1=3.78000, 10=3.39400, 75=3.20853, 150=2.78073, 525=2.36716, 1050=1.99640, 2550=1.89658, 5025=1.82528 (USD); RoHS: Yes; Case/Package: D; Number of Pins: 8; Weight: 0.002677oz; Min Operating Temperature: -40°C; Max Operating Temperature: 125°C; Packaging: Rail/Tube; Package Quantity: 75; Max Output Voltage: 31V; Max Output Current: 2A; Operating Supply Voltage: 36V; Length: 4.9mm; Height: 1.58mm; Width: 3.91mm; Radiation Hardening: No; Lead Free: Lead Free; REACH SVHC: No SVHC; ComponentLink1URL: https://datasheet.ciiva.com/4880/slvs642c-120503-4880259.pdf?src-supplier=Mouser; ComponentLink1Description: https://datasheet.ciiva.com/4880/slvs642c-120503-4880259.pdf?src-supplier=Mouser; ComponentLink2URL: https://datasheet.ciiva.com/15113/getdatasheetpartid-188336-15113748.pdf?src-supplier=Verical; ComponentLink2Description: https://datasheet.ciiva.com/15113/getdatasheetpartid-188336-15113748.pdf?src-supplier=Verical; ComponentLink3URL: https://datasheet.ciiva.com/27051/1113040-27051457.pdf?src-supplier=Jameco; ComponentLink3Description: https://datasheet.ciiva.com/27051/1113040-27051457.pdf?src-supplier=Jameco; ComponentLink4URL: https://datasheet.ciiva.com/26896/tps5420d-26896666.pdf?src-supplier=IIIC; ComponentLink4Description: https://datasheet.ciiva.com/26896/tps5420d-26896666.pdf?src-supplier=IIIC; ComponentLink5URL: https://datasheet.ciiva.com/2026/tps5420-2026757.pdf?src-supplier=Digi-Key; ComponentLink5Description: https://datasheet.ciiva.com/2026/tps5420-2026757.pdf?src-supplier=Digi-Key; ComponentLink6URL: https://datasheet.ciiva.com/7993/1764415-7993820.pdf?src-supplier=Element14; ComponentLink6Description: https://datasheet.ciiva.com/7993/1764415-7993820.pdf?src-supplier=Element14; ComponentLink7URL: https://datasheet.ciiva.com/3220/tps5420-3220182.pdf?src-supplier=Avnet; ComponentLink7Description: https://datasheet.ciiva.com/3220/tps5420-3220182.pdf?src-supplier=Avnet; ComponentLink8URL: https://datasheet.ciiva.com/26248/tps5420-26248554.pdf?src-supplier=Avnet+Europe; ComponentLink8Description: https://datasheet.ciiva.com/26248/tps5420-26248554.pdf?src-supplier=Avnet+Europe; Supplier Part Number 1: 296-19671-5-ND
U22 = INA240A3: IC AMP CURRENT SENSE 8-TSSOP 100V/V; Manufacturer: Texas Instruments; Number of Circuits: 1; Slew Rate: 2V/µs; -3db Bandwidth: 400kHz; Input Bias Current: 90uA; Input Offset Voltage (Vos): 5uV; Operating Supply Current: 1.8mA; Supplier 1: Digi-Key; Stock 1: 4680; Pricing 1: 1=2.65, 10=2.377, 25=2.2428, 100=1.7943, 250=1.56996, 500=1.52512, 1000=1.21113 (USD); Mount: Surface Mount; Case/Package: TSSOP; Number of Pins: 8; Min Operating Temperature: -40°C; Max Operating Temperature: 125°C; Packaging: Tape and Reel; ComponentLink1URL: http://www.ti.com/general/docs/lit/getliterature.tsp?genericPartNumber=INA240&fileType=pdf&src-supplier=Farnell; ComponentLink1Description: http://www.ti.com/general/docs/lit/getliterature.tsp?genericPartNumber=INA240&fileType=pdf&src-supplier=Farnell; ComponentLink2URL: http://www.ti.com/lit/ds/symlink/ina240.pdf?src-supplier=Digi-Key; ComponentLink2Description: http://www.ti.com/lit/ds/symlink/ina240.pdf?src-supplier=Digi-Key; Supplier Part Number 1: 296-45090-1-ND
U23 = TL072CDR: IC OPAMP JFET 3MHZ 8SOIC; Manufacturer: Texas Instruments; Voltage Gain: 106.02dB; Min Dual Supply Voltage: 3.5V; Max Dual Supply Voltage: 18V; Nominal Supply Current: 5mA; Common Mode Rejection Ratio: 70dB; Number of Channels: 2; Slew Rate: 13V/µs; Max I/O Voltage: 10mV; Input Bias Current: 200pA; Operating Supply Current: 1.4mA; Dual Supply Voltage: 9V; Supplier 1: Digi-Key; Stock 1: 21821; Pricing 1: 1=0.41, 10=0.334, 100=0.2059, 500=0.1562, 1000=0.11715 (USD); Case/Package: D; Number of Pins: 8; Contact Plating: Gold; Min Operating Temperature: -40°C; Max Operating Temperature: 85°C; Package Quantity: 1; Packaging: Tape and Reel; Unity Gain Bandwidth Product: 3MHz; Bandwidth: 3MHz; Nominal Gain Bandwidth Product: 3MHz; Number of Circuits: 2; Gain Bandwidth Product: 3MHz; Input Offset Voltage (Vos): 10mV; Number of Elements: 2; Max Supply Voltage: 18V; Number of Amplifiers: 2; Length: 4.9mm; Height: 1.58mm; Width: 3.91mm; Radiation Hardening: No; Lead Free: Lead Free; REACH SVHC: No SVHC; ComponentLink1URL: http://www.ti.com/lit/ds/symlink/tl071a.pdf?src-supplier=Digi-Key; ComponentLink1Description: http://www.ti.com/lit/ds/symlink/tl071a.pdf?src-supplier=Digi-Key; ComponentLink2URL: http://www.ti.com/general/docs/lit/getliterature.tsp?genericPartNumber=TL072&&fileType=pdf&src-supplier=Avnet; ComponentLink2Description: http://www.ti.com/general/docs/lit/getliterature.tsp?genericPartNumber=TL072&&fileType=pdf&src-supplier=Avnet; ComponentLink3URL: http://www.farnell.com/datasheets/1882732.pdf?src-supplier=Element14; ComponentLink3Description: http://www.farnell.com/datasheets/1882732.pdf?src-supplier=Element14; Supplier Part Number 1: 296-1282-6-ND

## Sheet dac.SchDoc
size A4

### Notes on the sheet
- Title
- Engineer:
- Date:
- Time:
- Revision:
- Sheet
- of
- File:

## Sheet pi.SchDoc
size A4

### Notes on the sheet
- Title
- Engineer:
- Date:
- Time:
- Revision:
- Sheet
- of
- File:

## Sheet current_source.SchDoc
size A4

### Notes on the sheet
- Title
- Engineer:
- Date:
- Time:
- Revision:
- Sheet
- of
- File:

## Sheet mosfet.SchDoc
size A4

### Notes on the sheet
- Title
- Engineer:
- Date:
- Time:
- Revision:
- Sheet
- of
- File:

## Sheet relay.SchDoc
size A4

### Notes on the sheet
- Title
- Engineer:
- Date:
- Time:
- Revision:
- Sheet
- of
- File:

## Sheet connectors.SchDoc
size A4

### Notes on the sheet
- Title
- Engineer:
- Date:
- Time:
- Revision:
- Sheet
- of
- File:

## Sheet testing_board.SchDoc
size A4

### Notes on the sheet
- Title
- Engineer:
- Date:
- Time:
- Revision:
- Sheet
- of
- File:

## Sheet serial.SchDoc
size A4

### Notes on the sheet
- Title
- Engineer:
- Date:
- Time:
- Revision:
- Sheet
- of
- File:

## Nets that join several sheets
GND: adc (20 pins), gpio (12 pins), power_5V (23 pins)
V-POS5V: adc (24 pins), gpio (10 pins), power_5V (9 pins)
I2C1_SCL: adc (R9.2 R20.2), gpio (R74.2 R86.2)
I2C1_SDA: adc (R8.2 R19.2), gpio (R73.2 R85.2)
I2C2_SCL: adc (R7.2 R18.2), gpio (R75.2 R87.2)
I2C2_SDA: adc (R6.2 R17.2), gpio (R76.2 R88.2)
TELEM_I_5V: adc (U2.14), power_5V (C61.1 R144.2 TP38.1)
TELEM_V_5V: adc (U2.11), power_5V (C64.1 R147.2)